# Altium schematic sheet SX1278_RADIO.SchDoc
size B; SheetNumber: 6; SheetTotal: 7
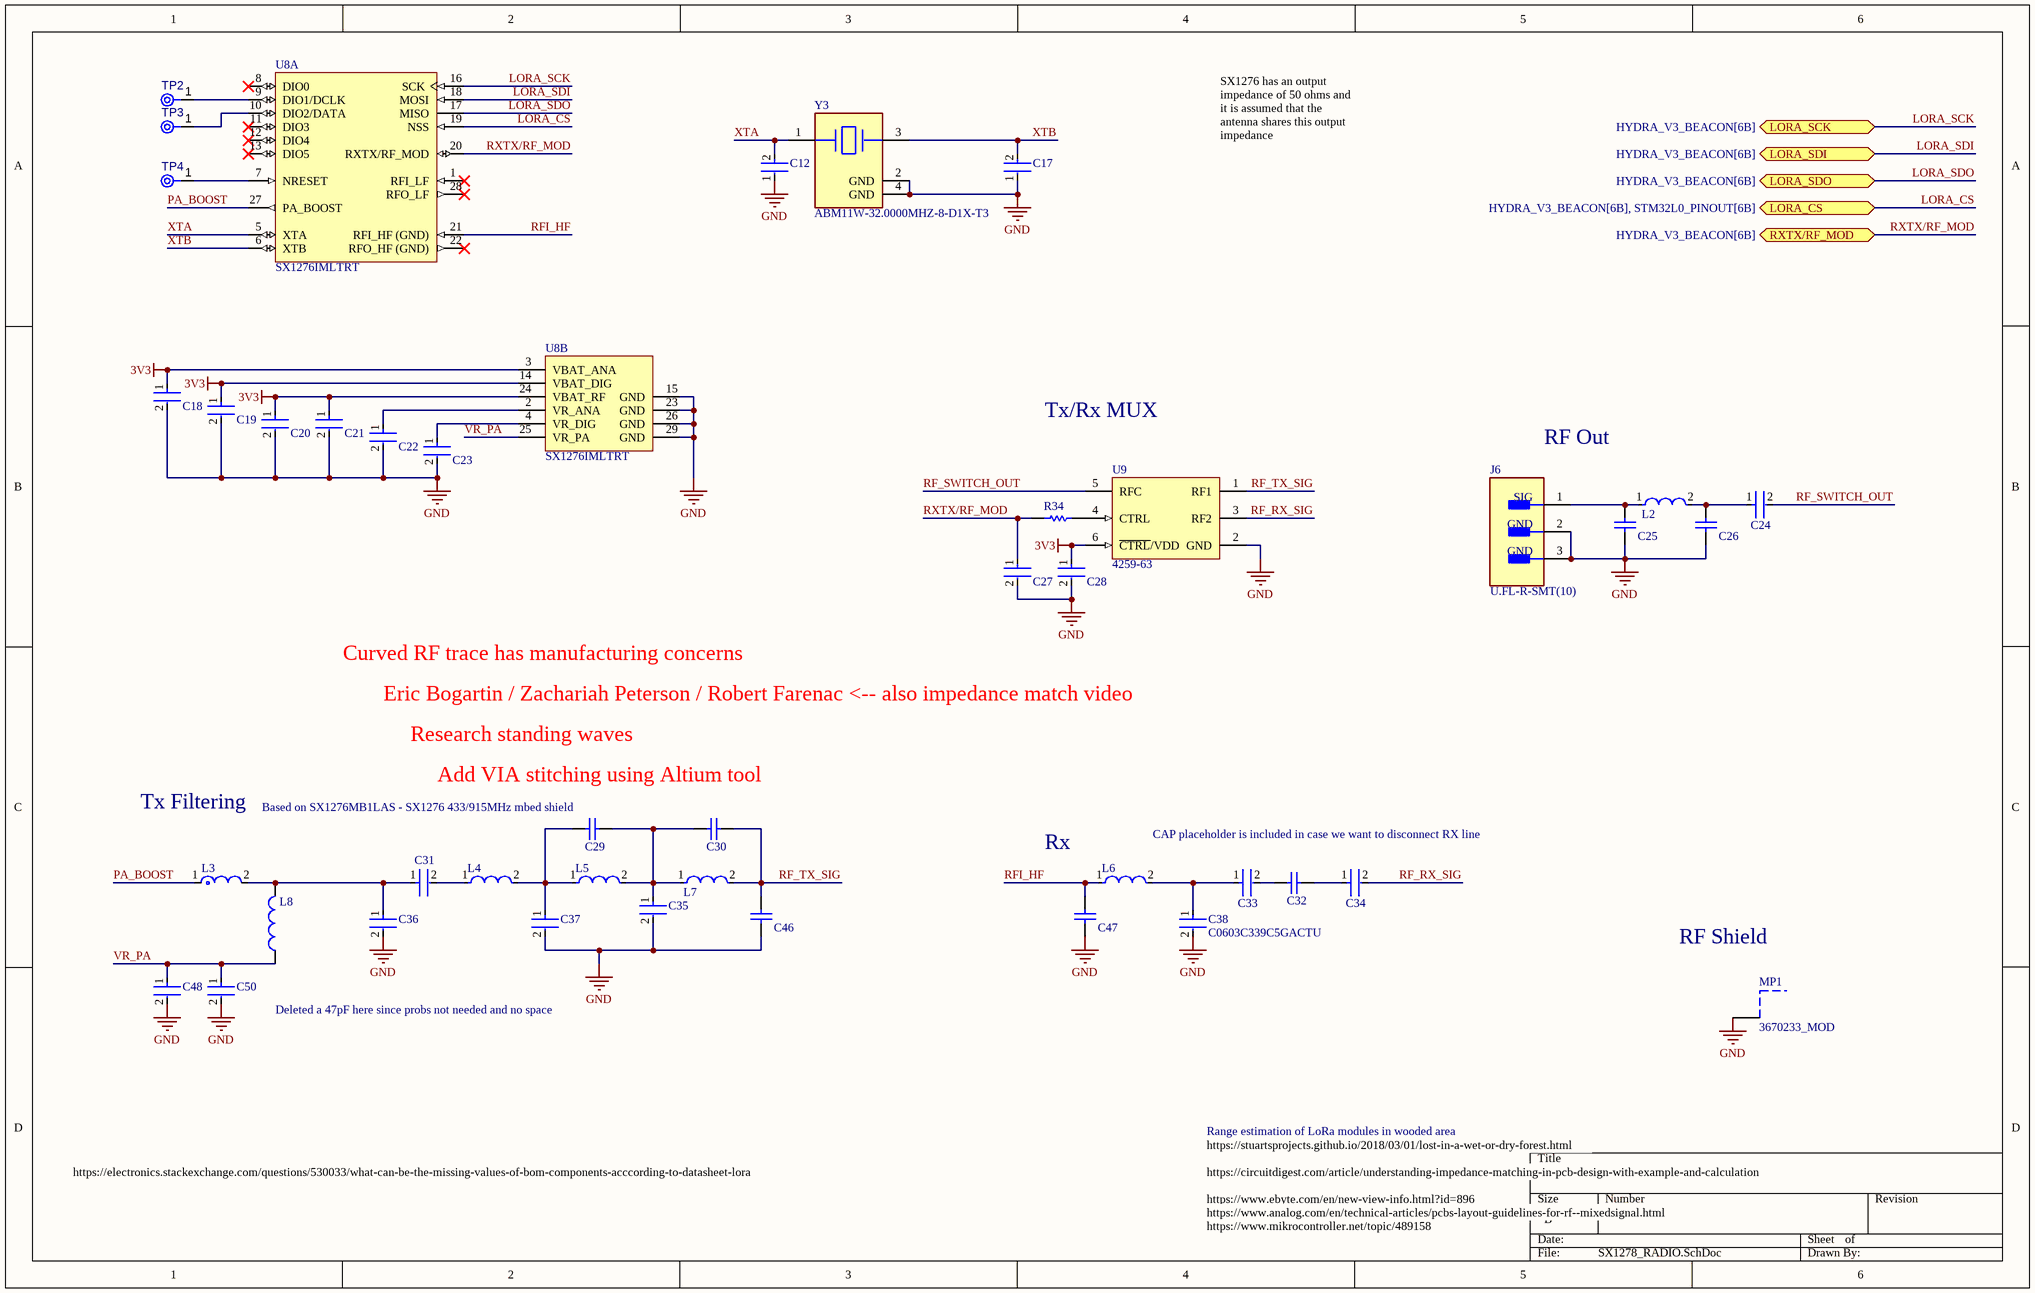
[diagram p0: SX1278_RADIO.SchDoc]

## Parts
C12  C1608C0G1H080D080AA  [FP-C1608-080-0_1-IPC_A]  (value not drawn)
C17  C1608C0G1H080D080AA  [FP-C1608-080-0_1-IPC_A]  (value not drawn)
C18  C0402C104K8PACTU  [FP-C0402-BB-MFG]  (value not drawn)
C19  C0402C104K8PACTU  [FP-C0402-BB-MFG]  (value not drawn)
C20  C0402C104K8PACTU  [FP-C0402-BB-MFG]  (value not drawn)
C21  C0402C104K8PACTU  [FP-C0402-BB-MFG]  (value not drawn)
C22  C0402C104K8PACTU  [FP-C0402-BB-MFG]  (value not drawn)
C23  C0402C104K8PACTU  [FP-C0402-BB-MFG]  (value not drawn)
C24  C0603C470J1GACTU  [FP-C0603C-CF-MFG]  (value not drawn)
C25  0603 CAP  [CAPC1608X90X40ML10T20]  (value not drawn)
C26  0603 CAP  [CAPC1608X90X40ML10T20]  (value not drawn)
C27  C0402C104K8PACTU  [FP-C0402-BB-MFG]  (value not drawn)
C28  C0402C104K8PACTU  [FP-C0402-BB-MFG]  (value not drawn)
C29  0603 CAP  [CAPC1608X90X40ML10T20]  (value not drawn)
C30  0603 CAP  [CAPC1608X90X40ML10T20]  (value not drawn)
C31  C0603C220J5GACTU  [FP-C0603C-CF-MFG]  (value not drawn)
C32  0603 CAP  [CAPC1608X90X40ML10T20]  (value not drawn)
C33  C0603C470J1GACTU  [FP-C0603C-CF-MFG]  (value not drawn)
C34  C0603C470J1GACTU  [FP-C0603C-CF-MFG]  (value not drawn)
C35  C0603C339C5GACTU  [FP-C0603C-CF-MFG]  (value not drawn)
C36  C0603C829C5GACTU  [FP-C0603C-CF-MFG]  (value not drawn)
C37  06031A6R8CAT2A  [FP-0603-L_1_6_0_15-W_0_81-IPC_C]  (value not drawn)
C38  C0603C339C5GACTU  [FP-C0603C-CF-MFG]
C46  0603 CAP  [CAPC1608X90X40ML10T20]  (value not drawn)
C47  0603 CAP  [CAPC1608X90X40ML10T20]  (value not drawn)
C48  C0603C103J3GACTU  [FP-C0603C-CF-MFG]  (value not drawn)
C50  C0603C470J1GACTU  [FP-C0603C-CF-MFG]  (value not drawn)
J6  U.FL-R-SMT(10)  [FP-U_FL-R-SMT_10-MFG]
L2  0603 IND  [FP-LQW18AN_00-MFG]  (value not drawn)
L3  LQG18HN1N5S00D  [FP-LQG18HH_00-IPC_B]  (value not drawn)
L4  LQW18AN5N6D00D  [FP-LQW18AN_00-MFG]  (value not drawn)
L5  LQW18AN5N6D00D  [FP-LQW18AN_00-MFG]  (value not drawn)
L6  LQW18AN10NG00D  [FP-LQW18AN_00-MFG]  (value not drawn)
L7  0603 IND  [FP-LQW18AN_00-MFG]  (value not drawn)
L8  B82496C3330J  [INDC1608X90X30LL10T20]  (value not drawn)
MP1  3670233_MOD  [3670233]
R34  ERJ-3EKF1001V  [RESC1608X55X30LL15T15]  (value not drawn)
TP2  TPAD6R  [TP06R]  (value not drawn)  (no BOM)
TP3  TPAD6R  [TP06R]  (value not drawn)  (no BOM)
TP4  TPAD6R  [TP06R]  (value not drawn)  (no BOM)
U8  SX1276IMLTRT  [SMTC-QFN-28_V]  (parts A,B of 2)
U9  4259-63  [PERE-SC-70-6_M]
Y3  ABM11W-32.0000MHZ-8-D1X-T3  [FP-ABM11W-MFG]

## Ports
LORA_CS (bidir, see HYDRA_V3_BEACON[6B], STM32L0_PINOUT[6B]), LORA_SCK (bidir, see HYDRA_V3_BEACON[6B]), LORA_SDI (bidir, see HYDRA_V3_BEACON[6B]), LORA_SDO (bidir, see HYDRA_V3_BEACON[6B]), RXTX/RF_MOD (bidir, see HYDRA_V3_BEACON[6B])

## Nets
3V3: C18.1 C19.1 C20.1 C21.1 C28.1 U8.3(VBAT_ANA) U8.14(VBAT_DIG) U8.24(VBAT_RF) U9.6(~{CTRL}/VDD)
GND: C12.1 C17.1 C18.2 C19.2 C20.2 C21.2 C22.2 C23.2 C25.1 C26.1 C27.2 C28.2 C35.2 C36.2 C37.2 C38.2 C46.1 C47.1 C48.2 C50.2 J6.2(GND) J6.3(GND) MP1.1 U8.15(GND) U8.23(GND) U8.26(GND) U8.29(GND) U9.2(GND) Y3.2(GND) Y3.4(GND)
LORA_CS: U8.19(NSS) ; port LORA_CS
LORA_SCK: U8.16(SCK) ; port LORA_SCK
LORA_SDI: U8.18(MOSI) ; port LORA_SDI
LORA_SDO: U8.17(MISO) ; port LORA_SDO
PA_BOOST: L3.1 U8.27(PA_BOOST)
RF_RX_SIG: C34.2 U9.3(RF2)
RF_SWITCH_OUT: C24.2 U9.5(RFC)
RF_TX_SIG: C30.2 C46.2 L7.2 U9.1(RF1)
RFI_HF: C47.2 L6.1 U8.21(RFI_HF_(GND))
RXTX/RF_MOD: C27.1 R34.2 U8.20(RXTX/RF_MOD) ; port RXTX/RF_MOD
VR_PA: C48.1 C50.1 L8.1 U8.25(VR_PA)
XTA: C12.2 U8.5(XTA) Y3.1
XTB: C17.2 U8.6(XTB) Y3.3
NetC22_1: C22.1 U8.2(VR_ANA)
NetC23_1: C23.1 U8.4(VR_DIG)
NetC24_1: C24.1 C26.2 L2.2
NetC25_2: C25.2 J6.1(SIG) L2.1
NetC29_1: C29.1 C37.1 L4.2 L5.1
NetC29_2: C29.2 C30.1 C35.1 L5.2 L7.1
NetC31_1: C31.1 C36.1 L3.2 L8.2
NetC31_2: C31.2 L4.1
NetC32_1: C32.1 C33.2
NetC32_2: C32.2 C34.1
NetC33_1: C33.1 C38.1 L6.2
NetR34_1: R34.1 U9.4(CTRL)
NetTP2_1: TP2.1(TP) U8.9(DIO1/DCLK)
NetTP3_1: TP3.1(TP) U8.10(DIO2/DATA)
NetTP4_1: TP4.1(TP) U8.7(NRESET)

Not connected (* = marked no-connect by the designer): U8 1(RFI_LF)* 8(DIO0)* 11(DIO3)* 12(DIO4)* 13(DIO5)* 22(RFO_HF_(GND))* 28(RFO_LF)*

## Notes on the sheet
- SX1276 has an output impedance of 50 ohms and it is assumed that the antenna shares this output impedance
- Tx/Rx MUX
- RF Out
- Curved RF trace has manufacturing concerns
- Eric Bogartin / Zachariah Peterson / Robert Farenac <-- also impedance match video
- Research standing waves
- Tx Filtering
- (near C29) Based on SX1276MB1LAS - SX1276 433/915MHz mbed shield
- Add VIA stitching using Altium tool
- CAP placeholder is included in case we want to disconnect RX line
- Rx
- RF Shield
- Deleted a 47pF here since probs not needed and no space
- https://electronics.stackexchange.com/questions/530033/what-can-be-the-missing-values-of-bom-components-acccording-to-datasheet-lora
- https://stuartsprojects.github.io/2018/03/01/lost-in-a-wet-or-dry-forest.html
- https://circuitdigest.com/article/understanding-impedance-matching-in-pcb-design-with-example-and-calculation
- Range estimation of LoRa modules in wooded area
- https://www.ebyte.com/en/new-view-info.html?id=896
- https://www.mikrocontroller.net/topic/489158
- https://www.analog.com/en/technical-articles/pcbs-layout-guidelines-for-rf--mixedsignal.html

## Library data of the parts
C12 C17 = CMP-08246-005081-1: Multilayer Ceramic Capacitors 8pF ±0.5pF 50V C0G SMD 0603; Insulation Resistance: 10GR; Case Code (Metric): 1608; Series: C; Construction: Flat; REACH SVHC: No SVHC; Weight: 7.1E-05oz; Length: 1.6mm; RoHS Compliant: Yes; Min Operating Temperature: -55°C; Dielectric Material: Ceramic; Dielectric: C0G; Case/Package: 0603; Width: 0.031inch; Lead Free: Lead Free; Voltage Rating (DC): 50V; Thickness: 0.037inch; Capacitance: 8pF; Radiation Hardening: No; Height: 0.8mm; Voltage Rating: 50V; Depth: 0.8mm; Package Quantity: 1; Termination: SMD/SMT; Mount: Surface Mount; Packaging: Tape and Reel; Case Code (Imperial): 0603; Max Operating Temperature: 125°C
C18-C23 C27 C28 = CMP-2008-02046-2: CAP CER 0.1UF 10V X5R 0402; Manufacturer: Kemet; Material: Ceramic; Capacitance: 0.10 μF; Temperature Coefficient: 15%; Tolerance: 0.1; Value: 0.10 μF; Package: C0402-BB; Temperature: -55°C to +125°C; ComponentLink2Description: Datasheet; Temperature Characteristic: X5R; Device Class L1: Passive Components; Height: 0.55mm; Lead Free: Yes; ComponentLink2URL: https://content.kemet.com/datasheets/KEM_C1002_X7R_SMD.pdf; Device Class L2: Capacitors; Temperature Range Low: -55°C; Temperature Range High: +125°C; RoHS: TRUE; Octopart: https://octopart.com/c0402c104k8pactu-kemet-140039; Automotive: No; Mouser Description: Capacitor 100 nF 10 VDC 0402; Category: Cap; Voltage Rating: 10 V; Digikey Description: CAP CER 0.1UF 10V X5R 0402; Ipc Land Pattern Name: CAPC10050X50; Device Class L3: Ceramic Capacitors; Manufacturer Part Number: C0402C104K8PACTU
C24 C33 C34 C50 = CMP-2006-03321-2: CAP CER 47PF 100V 5% NP0 0603; Manufacturer: KEMET; Temperature Characteristic: C0G; Temperature Coefficient: 30ppm/°C; Automotive Grade: Grade 1; Material: Ceramic; Tolerance: 0.05; Digikey Description: CAP CER 47PF 100V 5% NP0 0603; Value: 47 pF; Category: Cap; Device Class L2: Capacitors; Device Class L1: Passive Components; Package: C0603C-CF; Octopart: https://octopart.com/c0603c470j1gactu-kemet-3768219; Lead Free: Yes; Temperature Range High: +125°C; Device Class L3: Ceramic Capacitors; Height: 0.87mm; Temperature: -55°C to +125°C; Mouser Description: Multilayer Ceramic Capacitors MLCC - SMD/SMT 100volts 47pF C0G 5%; Automotive: Yes; Capacitance: 47 pF; RoHS: TRUE; ComponentLink2URL: https://api.kemet.com/component-edge/download/datasheet/C0603C100J5GACAUTO.pdf; Voltage Rating: 100 V; Manufacturer Part Number: C0603C470J1GACTU; ComponentLink2Description: Datasheet; Temperature Range Low: -55°C
C25 C26 C29 C30 C32 C46 C47 = CMP-001-00087-1: 0pF 0603 capacitor placeholder
C31 = CMP-2006-03119-3: Cap Ceramic 22pF 50V C0G 5% SMD 0603 125°C Paper T/R; Manufacturer: KEMET; Temperature Coefficient: 30ppm/°C; Automotive Grade: Grade 1; Tolerance: 0.05; RoHS: TRUE; Temperature Characteristic: C0G; Capacitance: 22 pF; Device Class L3: Ceramic Capacitors; Digikey Description: Cap Ceramic 22pF 50V C0G 5% SMD 0603 125°C Paper T/R; ComponentLink2URL: https://api.kemet.com/component-edge/download/datasheet/C0603C100J5GACAUTO.pdf; ComponentLink2Description: Datasheet; Automotive: Yes; Temperature: -55°C to +125°C; Temperature Range High: +125°C; Package: C0603C-CF; Device Class L1: Passive Components; Device Class L2: Capacitors; Lead Free: Yes; Value: 22 pF; Manufacturer Part Number: C0603C220J5GACTU; Category: Cap; Mouser Description: Cap Ceramic 22pF 50V C0G 5% SMD 0603 125°C Paper T/R; Voltage Rating: 50 V; Height: 0.87mm; Material: Ceramic; Temperature Range Low: -55°C; Octopart: https://octopart.com/c0603c220j5gactu-kemet-98525
C35 C38 = CMP-1035-00238-3: CAP CER 3.3PF 50V NP0 0603; Manufacturer: KEMET; Tolerance: 0.25 pF; Material: Ceramic; Temperature Characteristic: C0G; Automotive Grade: Grade 1; Temperature Coefficient: 30ppm/°C; Height: 0.87mm; Category: Cap; Automotive: Yes; Voltage Rating: 50 V; Capacitance: 3.3 pF; ComponentLink2Description: Datasheet; Octopart: https://octopart.com/c0603c339c5gactu-kemet-3701205; Temperature Range Low: -55°C; Device Class L3: Ceramic Capacitors; Manufacturer Part Number: C0603C339C5GACTU; Package: C0603C-CF; Temperature: -55°C to +125°C; Digikey Description: CAP CER 3.3PF 50V NP0 0603; Temperature Range High: +125°C; ComponentLink2URL: https://api.kemet.com/component-edge/download/datasheet/C0603C100J5GACAUTO.pdf; Device Class L1: Passive Components; Value: 3.3 pF; RoHS: TRUE; Lead Free: Yes; Mouser Description: Multilayer Ceramic Capacitors MLCC - SMD/SMT 50volts 3.3pF C0G 0.25%; Device Class L2: Capacitors
C36 = CMP-2006-03332-2: CAP CER 8.2PF 50V NP0 0603; Manufacturer: KEMET; Temperature Coefficient: 30ppm/°C; Temperature Characteristic: C0G; Material: Ceramic; Tolerance: 0.25 pF; Automotive Grade: Grade 1; Octopart: https://octopart.com/c0603c829c5gactu-kemet-8375751; Automotive: Yes; RoHS: TRUE; Manufacturer Part Number: C0603C829C5GACTU; Temperature Range High: +125°C; Category: Cap; Digikey Description: CAP CER 8.2PF 50V NP0 0603; Value: 8.2 pF; Temperature: -55°C to +125°C; Package: C0603C-CF; Device Class L1: Passive Components; Device Class L3: Ceramic Capacitors; Device Class L2: Capacitors; ComponentLink2Description: Datasheet; Height: 0.87mm; Capacitance: 8.2 pF; Lead Free: Yes; Voltage Rating: 50 V; Mouser Description: Multilayer Ceramic Capacitors MLCC - SMD/SMT 50volts 8.2pF C0G 0.25%; ComponentLink2URL: https://api.kemet.com/component-edge/download/datasheet/C0603C100J5GACAUTO.pdf; Temperature Range Low: -55°C
C37 = CMP-1035-00440-3: General Purpose Ceramic Capacitor, 0603, 6.8pF, 0.25pF, NP0, 30ppm/°C, 100V; Dielectric: C0G; Voltage Rating: 100V; Package Quantity: 1; Height: 0.86mm; Number of Pins: 2; Depth: 0.81mm; Voltage: 100V; Case Code (Imperial): 0603; Series: -; Case/Package: 0603; Capacitance: 6.8pF; Termination: SMD/SMT; Case Code (Metric): 1608; Lead Free: Lead Free; Voltage Rating (DC): 100V; Mount: Surface Mount; Dielectric Material: Ceramic; Packaging: Tape and Reel; Min Operating Temperature: -55°C; Construction: Flat; Width: 0.032inch; Thickness: 0.035inch; RoHS Compliant: Yes; Radiation Hardening: No; Max Operating Temperature: 125°C; Length: 1.6mm
C48 = CMP-2006-03705-3: CAP CER 10000PF 25V 5% NP0 0603; Manufacturer: KEMET; Material: Ceramic; Temperature Coefficient: 30ppm/°C; Automotive Grade: Grade 1; Capacitance: 10,000 pF; Temperature Characteristic: C0G; Value: 10,000 pF; Tolerance: 0.05; Temperature: -55°C to +125°C; ComponentLink2URL: https://api.kemet.com/component-edge/download/datasheet/C0603C100J5GACAUTO.pdf; ComponentLink2Description: Datasheet; Digikey Description: CAP CER 10000PF 25V 5% NP0 0603; Octopart: https://octopart.com/c0603c103j3gactu-kemet-10686801; Package: C0603C-CF; Automotive: Yes; Category: Cap; Manufacturer Part Number: C0603C103J3GACTU; Voltage Rating: 25 V; RoHS: TRUE; Device Class L1: Passive Components; Temperature Range Low: -55°C; Lead Free: Yes; Height: 0.87mm; Temperature Range High: +125°C; Device Class L3: Ceramic Capacitors; Mouser Description: 0603 C 10nF Ceramic Multilayer Capacitor, 25 V, +125degC, C0G Dielectric, +/-5%; Device Class L2: Capacitors
J6 = CMP-0029-00003-2: CONN U.FL RCPT STR 50 OHM SMD; Plating: Silver; Connector Type: Coaxial; Frequency: 6GHz; Impedance: 50R; Body Material: Bronze; Dielectric Material: Polymer; Contact Plating: Gold; Termination: Solder; Orientation: Vertical; Contact Material: Brass; Min Operating Temperature: -40°C; Mount: Surface Mount; Lead Free: Lead Free; Max Operating Temperature: 90°C; Radiation Hardening: No; Packaging: Tape and Reel; Body Plating: Silver; Fastening Type: Snap; Max Frequency: 6GHz; Depth: 3.1mm; Package Quantity: 1; Case/Package: SMD/SMT; Housing Color: Beige; Length: 3mm
L2 L7 = CMP-006-00021-1: 0uH 0603 inductor placeholder
L3 = CMP-06042-002746-1: Multilayer type RF Inductor 1.5nH ±0.3nH 0.1Ω 1100mA 0603; DC Current: 500mA; DC Resistance (DCR): 100mR; Shielding: Unshielded; Core Material: Air; Self Resonant Frequency: 6GHz; Q Factor: 12; Test Frequency: 100MHz; Max Operating Temperature: 85°C; Length: 1.6mm; Radiation Hardening: No; Inductance: 1.5nH; Max DC Current: 500mA; Case/Package: 0603; Width: 0.8mm; Height: 0.8mm; Number of Pins: 2; Depth: 0.95mm; Mount: Surface Mount; Packaging: Tape and Reel; Height - Seated (Max): 0.037inch; Case Code (Metric): 1608; Package Quantity: 4000; Current Rating: 500mA; Lead Free: Lead Free; Military Standard: Not; Case Code (Imperial): 0603; Min Operating Temperature: -55°C; Termination: SMD/SMT; REACH SVHC: No SVHC
L4 L5 = CMP-06042-003914-1: Wire Wound RF Inductor 5.6nH ±0.5nH 750mA 0.082Ω 0603 (1608); Test Frequency: 100MHz; Self Resonant Frequency: 6GHz; Q Factor: 35; Core Material: Non-Magnetic; DC Resistance (DCR): 82mR; Shielding: Unshielded; Number of Pins: 2; Case Code (Imperial): 0603; Height: 0.8mm; Packaging: Tape and Reel; Case/Package: 0603; Lead Free: Lead Free; Height - Seated (Max): 0.039inch; Width: 0.8mm; Military Standard: Not; Weight: 0.000106oz; Length: 1.6mm; Case Code (Metric): 1608; Radiation Hardening: No; DC Current: 750mA; Resistor Type: Wirewound; Min Operating Temperature: -55°C; Max DC Current: 750mA; Package Quantity: 4000; Current Rating: 750mA; Termination: SMD/SMT; Depth: 1mm; Max Operating Temperature: 125°C; REACH SVHC: No SVHC; Mount: Surface Mount; Inductance: 5.6nH
L6 = CMP-2000-06599-2: Wire Wound RF Inductor 10nH ±2% 650mA 0.11Ω 0603 (1608); DC Resistance (DCR): 110mR; Q Factor: 35; Shielding: Unshielded; Test Frequency: 100MHz; Current: 550mA; Self Resonant Frequency: 6GHz; Radiation Hardening: No; Depth: 1mm; Case Code (Imperial): 0603; Inductance: 10nH; Inductance Tolerance: 2%; Series: LQW18A_00; Tolerance: 2%; Weight: 0.000106oz; Rated Current-Max: 650mA; Mount: Surface Mount; Series Resistance: 110mR; REACH SVHC: No SVHC; Current Rating: 650mA; Case Code (Metric): 1608; Lead Free: Lead Free; Resistor Type: Wirewound; Package Quantity: 4000; Termination: SMD/SMT; DC Current: 650mA; Height: 0.8mm; Min Operating Temperature: -55°C; Military Standard: Not; Max Operating Temperature: 125°C; Max DC Current: 650mA; Case/Package: 0603; Number of Pins: 2; Packaging: Tape and Reel; Width: 0.8mm; Length: 1.6mm
L8 = CMP-2000-05913-1: Unshielded Wirewound Inductor, 33 nH, 350 mA, -55 to 150 degC, 0603 (1608 Metric), RoHS, Tape and Reel; Manufacturer: EPCOS-(TDK); Q @ Freq: 14@100MHz; Inductance: 33nH; Material - Core: Ceramic; Frequency - Self Resonant: 3GHz; DC Resistance (DCR): 600mOhmMax; Tolerance: ±5%; Frequency - Test: 100MHz; Current Rating: 350mA; Manufacturer URL: http://www.tdk.com/; Type: Wirewound; Mounting Type: SurfaceMount; Mounting Technology: SurfaceMount; Height - Seated (Max): 0.035"(0.90mm); Datasheet URL: https://en.tdk.eu/inf/30/db/ind_2008/b82496c.pdf; Shielding: Unshielded; Operating Temperature: -; Size / Dimension: 0.063"Lx0.031"W(1.60mmx0.80mm); Series: SIMID; Current - Saturation: -; Ratings: AEC-Q200; Packaging: CutTape(CT); Package Reference: 0603; Datasheet Version: 07/2016; Category: Inductors,Coils,Chokes; Package Description: 2-Pin Surface Mount Device, Body 1.6 x 0.8 mm; Family: FixedInductors; Package / Case: 0603(1608Metric)
MP1 = CMP-00025-00007-1: WE-SHC Two-piece Seamless Shielding Cabinet - MODIFIED FOOTPRINT TO ALLOW RF SIGNAL TRACE THROUGH BOTTOM RIGHT
R34 = CMP-2000-00180-1: Manufacturer: Panasonic; Part Number: ERJ-3EKF1001V
TP2-TP4 = CMP-00028-00002-2: 0.6mm round; Pins: 1
U8 = CMP-2000-05356-1: Low Power Long Range Transceiver, 137 to 1020 MHz, -40 to 85 degC, 28-Pin QFN, RoHS, Tape and Reel; Manufacturer: Semtech; Power - Output: 20dBm; Data Rate (Max): 300kbps; Sensitivity: -148dBm; Featured Product: SX1276LongRangeTransceiver; PCN Design/Specification: CopperWire25/Mar/2014; GPIO: 6; Frequency: 137MHz~1.02GHz; Voltage - Supply: 1.8V~3.7V; Protocol: LoRa™; Current - Transmitting: 20mA~120mA; Current - Receiving: 10.8mA~12mA; Online Catalog: SX1276,SX1277andSX1278; Design Resources: SX127xReferenceDesignOverviewDevelopmentToolSelector; Serial Interfaces: SPI; Mfg Application Notes: LoRaModulation:CrystalOscillatorGuidanceSX12xxSoftwareImplementationofDataWhiteningandCRCSX127xLoRaLowEnergyDesignGuideSX127xLoRaModemDesignersGuide; Modulation: FSK,GFSK,GMSK,MSK,OOK; Other Names: SX1276IMLTRTTR; Series: -; Manufacturer URL: http://www.semtech.com/; Datasheet URL: http://www.semtech.com/images/datasheet/sx1276.pdf; Type: TxRx+MCU; RF Family/Standard: 802.15.4; Package Reference: QFN-28; Standard Package: 3,000; Package Description: 28-Pin Quad Flat No-lead Package, Body 6 x 6 mm, Pitch 0.65 mm; Category: RF/IFandRFID; Operating Temperature: -40degC~85degC; Datasheet Version: Rev. 4, 03/2015; Memory Size: -; Family: RFTransceiverICs; Packaging: Tape&Reel(TR); Package / Case: 28-VQFNExposedPad
U9 = CMP-2000-05298-1: IC RF Switch SPDT, 50 Ohm, 6-Pin SC70, RoHS, Tape and Reel; Manufacturer: Peregrine Semiconductor; P1dB: 29dBm(typ)IP1dB; Topology: Reflective; Frequency - Upper: 3GHz; Insertion Loss @ Frequency: 0.5dB@2GHz; IIP3: 55dBm(typ); Voltage - Supply: 1.8V~3.3V; Other Names: 1046-1011-24259-63-ND425963PE4259PE4259SCBC-ZPE4259SCBC-Z-ND; Isolation @ Frequency: 20dB@2GHz(typ); Frequency - Lower: 10MHz; Online Catalog: PE4259; Impedance: 50Ohm; RF Type: GeneralPurpose; Series: UltraCMOS; Manufacturer URL: http://www.psemi.com/; Package Description: 6-Pin Small Outline Transistor, Body 2.05 x 1.25 mm, Pitch 0.65 mm; Family: RFSwitches; Packaging: Tape&Reel(TR); Features: Single/DualLineControl; Package / Case: 6-TSSOP,SC-88,SOT-363; Operating Temperature: -40degC~85degC; Circuit: SPDT; Supplier Device Package: SC-70-6; Standard Package: 3,000; Datasheet URL: https://datasheet.ciiva.com/15100/getdatasheetpartid-685660-15100501.pdf; Category: RF/IFandRFID; Datasheet Version: Jan-11; Package Reference: SC-70-6
Y3 = CMP-27762-001566-1: Crystal 32MHz ±10ppm 8pF SMD-4 2mm x 1.6mm; ESR (Equivalent Series Resistance): 80R; Frequency Stability: 20ppm; Mount: Surface Mount; Packaging: Cut Tape; Case/Package: SMD/SMT; Min Operating Temperature: -40°C; Frequency: 32MHz; RoHS Compliant: Yes; Load Capacitance: 8pF; Max Operating Temperature: 85°C; Frequency Tolerance: 10ppm